# EAGLE design 5Vboostproto (EAGLE 7.1.0)
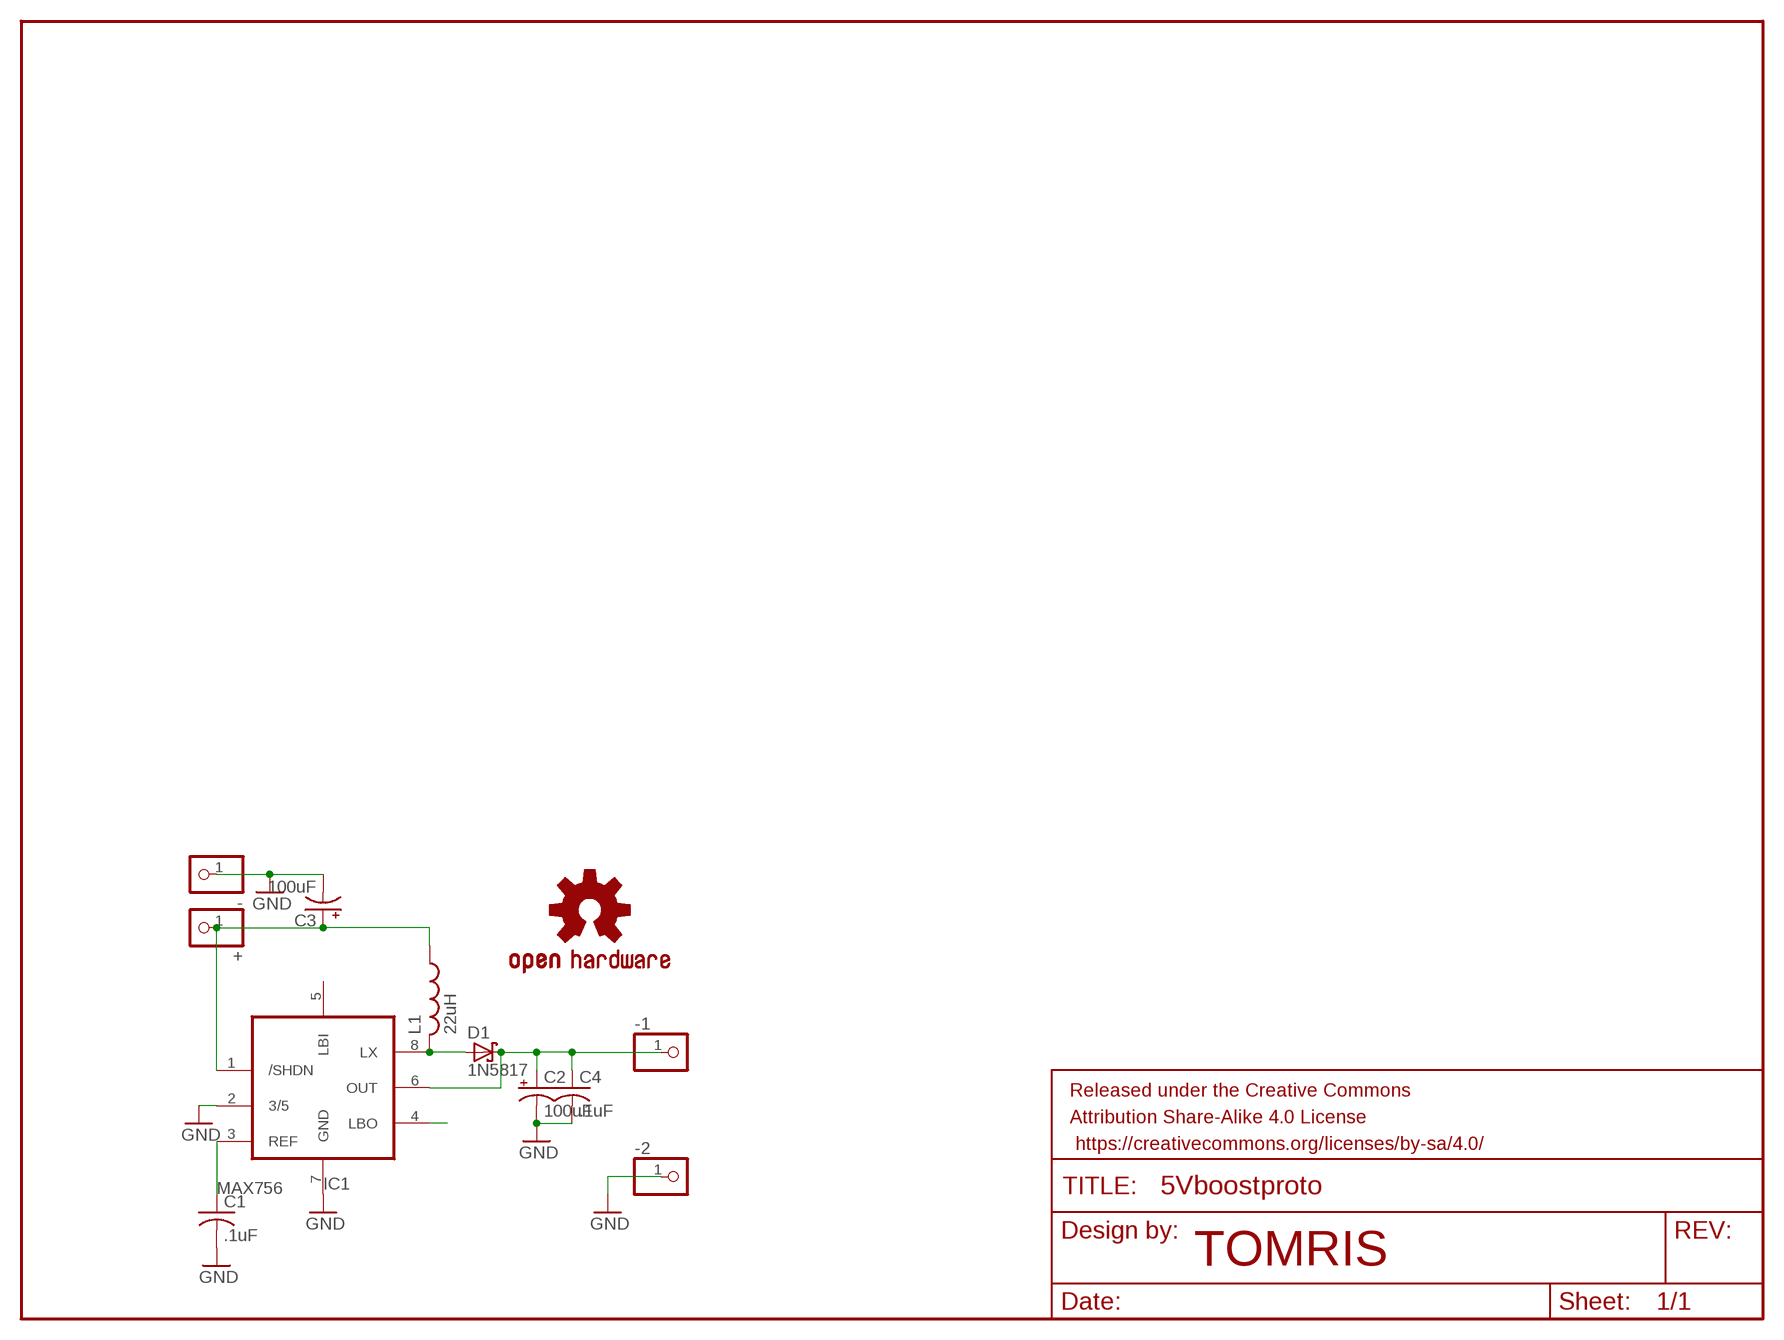
[diagram p0: schematic, sheet 1]

## Parts
+  PINHD-1X1  [1X01]
-  PINHD-1X1  [1X01]
-1  PINHD-1X1  [1X01]
-2  PINHD-1X1  [1X01]
C1  .1uF  C-US025-024X044  [C025-024X044]
C2  100uF  CPOL-USE2.5-5  [E2,5-5]
C3  100uF  CPOL-USE2.5-5  [E2,5-5]
C4  .1uF  C-US025-024X044  [C025-024X044]
D1  1N5817  SCHOTTKY-DIODEDO41  [DO41-10]
FRAME1  FRAME-LETTER  [CREATIVE_COMMONS]
IC1  MAX756  MAX756CPA  [DIL08]
L1  22uH  L2474/10  [2747]
LOGO1  OSHW-LOGOM  [OSHW-LOGO-M]

## Nets
GND: -2.1 -.1 C1.2 C2.- C3.- C4.2 IC1.2(3/5) IC1.7(GND)
N$1: C1.1 IC1.3(REF)
N$2: +.1 C3.+ IC1.1(/SHDN) L1.P$1
N$3: -1.1 C2.+ C4.1 D1.C IC1.6(OUT)
N$5: D1.A IC1.8(LX) L1.P$2
N$6: IC1.4(LBO)
Unconnected: IC1.5(LBI)

## Notes on the sheet
- TOMRIS

## Library data of the parts
+ - -1 -2 = pinhead-ez:PINHD-1X1: PIN HEADER
C1 C4 = rcl-ez:C-US: CAPACITOR, American symbol
C2 C3 = rcl-ez:CPOL-US: POLARIZED CAPACITOR, American symbol
D1 = usbbuck:SCHOTTKY-DIODE: Schottky Diode
FRAME1 = SparkFun-Aesthetics:FRAME-LETTER: Schematic Frame Standard 8.5x11 US Letter frame
IC1 = usbbuck:MAX756
L1 = usbbuck:L
LOGO1 = OSHW-LOGO-M-BOTTOMCOP:OSHW-LOGO: Open Source Hardware Logo This logo indicates the piece of hardware it is found on incorporates a OSHW license and/or adheres to the definition of open source hardware found here: http://freedomdefined.org/OSHW

## Board
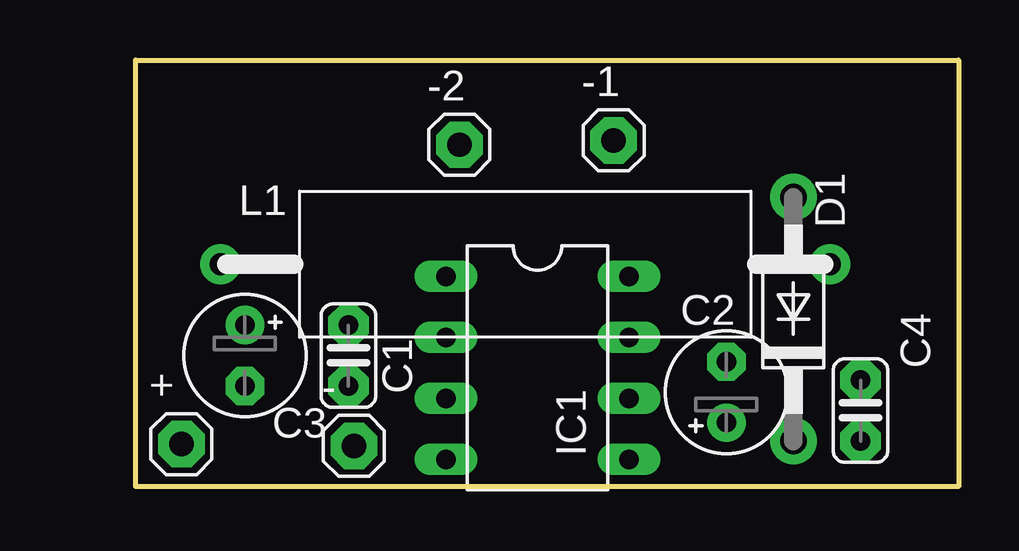
[diagram p1: board, top side]
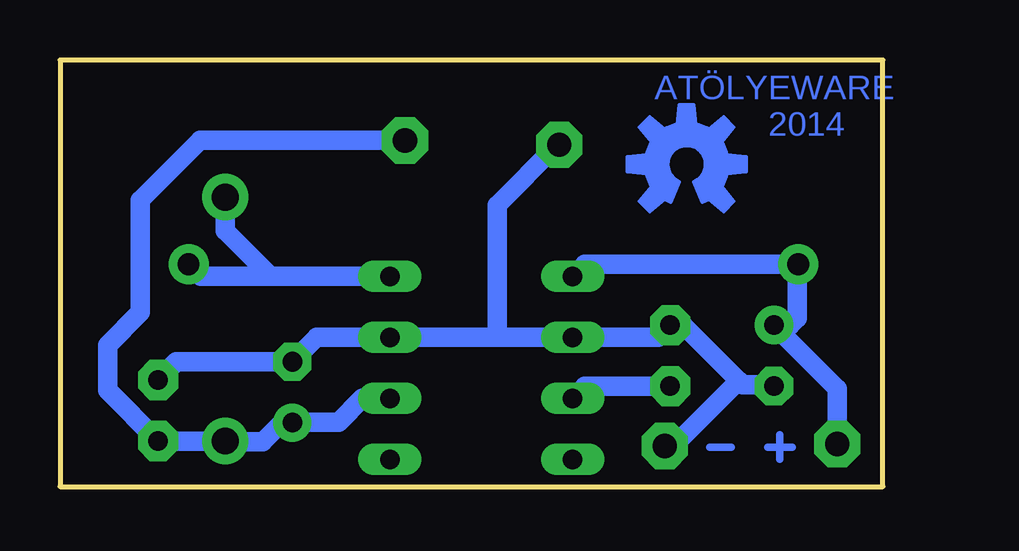
[diagram p2: board, bottom side, seen from below]

Size 34.29 x 17.78 mm. Coordinates in mm from the lower left corner, seen from the top.
Outline: 0,0 0,17.78 34.29,17.78 34.29,0 0,0
Copper layers (1*16): Top 0.035mm / dielectric 1.5mm / Bottom 0.035mm
Design rules "default": minimum track width 10mil, minimum drill 24mil, track to track 16mil, track to pad 16mil, pad to pad 16mil, via to via 16mil, smd to smd 8mil, copper to edge 10mil, drill to drill 8mil, minimum pad ring 10mil, minimum via ring 8mil, stop-mask expansion 4mil, vias tented up to drill 0mil, thermal gap 10mil

### Footprints (pad centres in the part's own frame; a part is rotated, then mirrored left to right if it is on the bottom)
1X01 = drill 1.016 pad 1.93 octagon: 1 0,0
C025-024X044 = drill 0.813 pad 1.676 octagon: 1 -1.27,0; 2 1.27,0
E2,5-5 = drill 0.813 pad 1.6: + -1.27,0 | drill 0.813 pad 1.6 octagon: - 1.27,0
DO41-10 = drill 1.118 pad 1.93: A 5.08,0; C -5.08,0
DIL08 = drill 0.813 long: 1 -3.81,-3.81; 2 -1.27,-3.81; 3 1.27,-3.81; 4 3.81,-3.81; 5 3.81,3.81; 6 1.27,3.81; 7 -1.27,3.81; 8 -3.81,3.81
2747 = drill 0.9 pad 1.676: P$1 -12.7,0; P$2 12.7,0

### Placement (x,y rotation side)
+  1.91,1.78 0 top
-  9.09,1.7 0 top
-1  19.91,14.43 0 top
-2  13.49,14.25 0 top
C1  8.86,5.46 90 top
C2  24.61,3.94 90 top
C3  4.55,5.46 270 top
C4  30.2,3.17 90 top
D1  27.41,6.99 90 top
FRAME1  0.23,18.95 0 top
IC1  16.74,4.95 270 top
L1  16.23,9.27 0 top
LOGO1  8.18,13.44 0 top

### Tracks (layer width: path | path; a pad name or v marks a point on that pad's centre or on a via)
GND
  Bottom 0.508: C1.2 8.61,6.73 8.87,6.99 C1.2
  Bottom 0.813: 16,6.22 IC1.2 9.37,6.22 C1.2 | 16,6.22 IC1.7 23.6,6.22 C2.- 29.44,5.21 C4.2 | -2.1 13.56,14.25 16.08,11.73 16.08,6.3 16,6.22 | 8.61,6.73 8.33,6.73 6.01,4.41 | 6.01,4.41 5.84,4.24 4.6,4.24 C3.- | -.1 8.71,1.7 6.01,4.41
N$1
  Bottom 0.813: C1.1 12.42,4.19 IC1.3
N$2
  Bottom 0.813: IC1.1 12.42,9.27 L1.P$1 3.58,9.22 3.58,7.01 3.86,6.73 C3.+ 1.91,4.09 +.1
N$3
  Bottom 0.813: IC1.6 21.69,3.68 22.68,2.69 24.59,2.69 C2.+ 25.04,2.67 25.83,1.88 27.38,1.88 D1.C C4.1 32.31,4.01 32.31,5.89 30.94,7.26 30.94,11.94 28.45,14.43 -1.1
N$4
  Bottom 0.305: 3.79,1.65 4.8,1.65
N$5
  Bottom 0.813: IC1.8 25.5,8.76 | 25.5,8.76 28.42,8.76 L1.P$2 | D1.A 27.41,10.67 25.5,8.76
N$7
  Bottom 0.305: 4.29,1.14 4.29,2.16
N$8
  Bottom 0.305: 6.33,1.65 7.21,1.65

### Text on the board
Bottom: ATÖLYEWARE / 2014
tTest: TOMRIS